# EAGLE design esp32_ili9488_module_board (EAGLE 9.6.2)
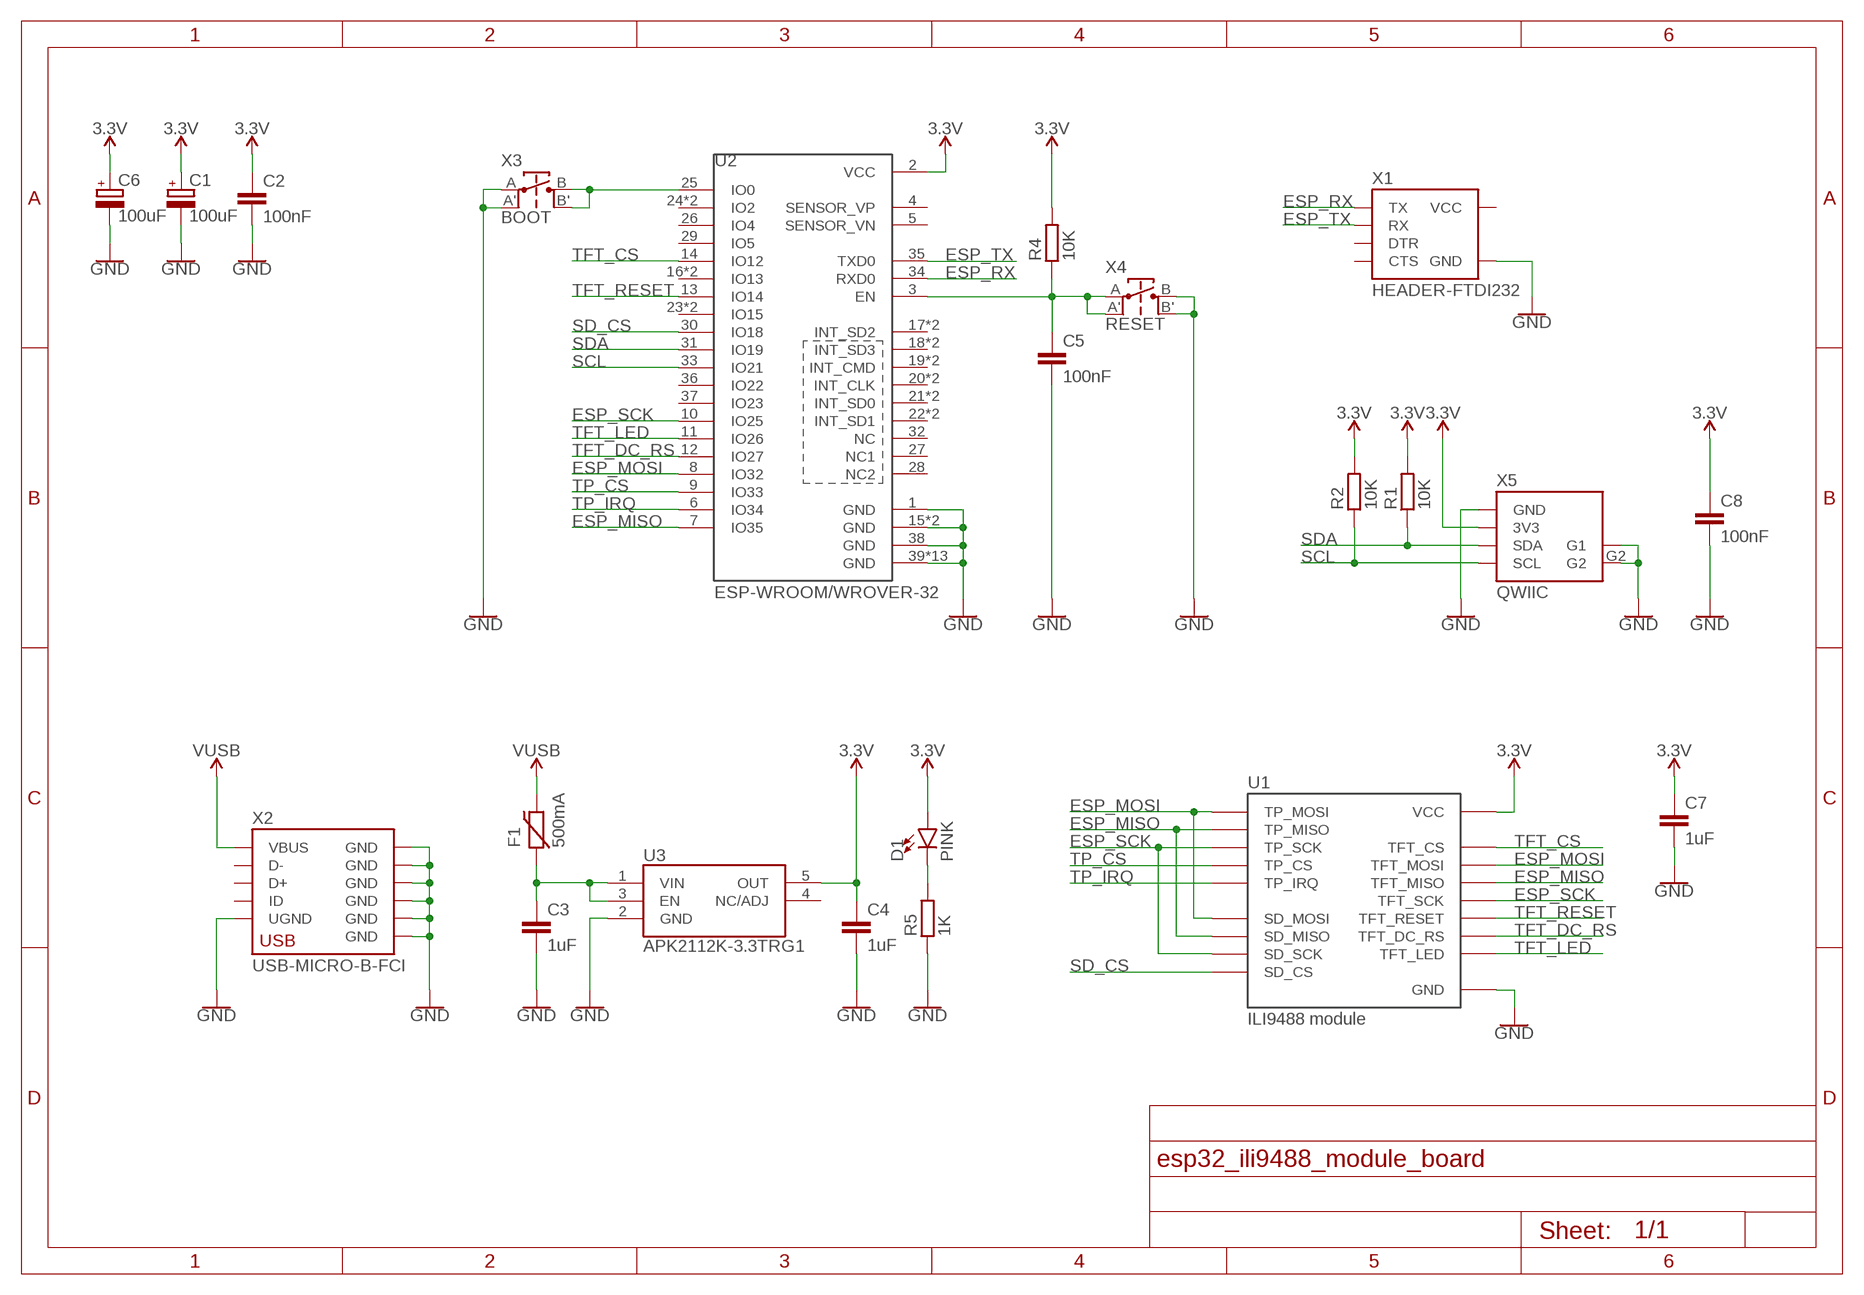
[diagram p0: schematic, sheet 1]

## Parts
C1  100uF  CAP-POL-ALUMPANASONIC-SV-C  [PANASONIC-SV-C]
C2  100nF  CAPC0603  [C0603]
C3  1uF  CAPC0603  [C0603]
C4  1uF  CAPC0603  [C0603]
C5  100nF  CAPC0603  [C0603]
C6  100uF  CAP-POL-ALUMPANASONIC-SV-C  [PANASONIC-SV-C]
C7  1uF  CAPC0603  [C0603]
C8  100nF  CAPC0603  [C0603]
D1  PINK  LED0603  [LED0603]
F1  500mA  PTC0ZCJ  [PTC-0ZCJ-1206]
R1  10K  RESISTOR0603  [R0603]
R2  10K  RESISTOR0603  [R0603]
R4  10K  RESISTOR0603  [R0603]
R5  1K  RESISTOR0603  [R0603]
U1  ILI9488 module  TFT-ILI9488-MODULE  [TFT-ILI9488-MODULE]
U2  ESP-WROOM/WROVER-32  ESP-WROOM_WROVER-32  [ESP-WROOM_WROVER-32]
U3  APK2112K-3.3TRG1  REGULATOR-AP2112KK-SOT23-5  [SOT23-5]
X1  HEADER-FTDI232  [FTDI232-1X06]
X2  USB-MICRO-B-FCI  [USB-MICRO-B-FCI]
X3  BOOT  TACT-SWITCHEVQ  [TACT-SWITCH-EVQ]
X4  RESET  TACT-SWITCHEVQ  [TACT-SWITCH-EVQ]
X5  QWIIC  QWIICRA  [JST-SH-4-SMD-RA]

## Nets
3.3V: C1.+ C2.1 C4.1 C6.+ C7.1 C8.1 D1.A R1.2 R2.2 R4.2 U1.VCC U2.2(VCC) U3.5(OUT) X5.3V3
ESP_MISO: U1.SD_MISO U1.TFT_MISO U1.TP_MISO U2.7(IO35)
ESP_MOSI: U1.SD_MOSI U1.TFT_MOSI U1.TP_MOSI U2.8(IO32)
ESP_RX: U2.34(RXD0) X1.TX
ESP_SCK: U1.SD_SCK U1.TFT_SCK U1.TP_SCK U2.10(IO25)
ESP_TX: U2.35(TXD0) X1.RX
GND: C1.- C2.2 C3.2 C4.2 C5.2 C6.- C7.2 C8.2 R5.1 U1.GND U2.1(GND) U2.15(GND) U2.15_R(GND) U2.38(GND) U2.39(GND) U2.39V_1(GND) U2.39V_2(GND) U2.39V_3(GND) U2.39V_4(GND) U2.39V_5(GND) U2.39V_6(GND) U2.39V_7(GND) U2.39V_8(GND) U2.39V_9(GND) U2.39V_10(GND) U2.39V_12(GND) U2.39V_13(GND) U3.2(GND) X1.GND X2.5(UGND) X2.GND@1(GND) X2.GND@2(GND) X2.GND@3(GND) X2.GND@4(GND) X2.GND@5(GND) X2.GND@6(GND) X3.A X3.A' X4.B X4.B' X5.G1 X5.G2 X5.GND
N$1: C3.1 F1.1 U3.1(VIN) U3.3(EN)
N$2: D1.C R5.2
N$3: C5.1 R4.1 U2.3(EN) X4.A X4.A'
N$4: U2.25(IO0) X3.B X3.B'
SCL: R2.1 U2.33(IO21) X5.SCL
SD_CS: U1.SD_CS U2.30(IO18)
SDA: R1.1 U2.31(IO19) X5.SDA
TFT_CS: U1.TFT_CS U2.14(IO12)
TFT_DC_RS: U1.TFT_DC_RS U2.12(IO27)
TFT_LED: U1.TFT_LED U2.11(IO26)
TFT_RESET: U1.TFT_RESET U2.13(IO14)
TP_CS: U1.TP_CS U2.9(IO33)
TP_IRQ: U1.TP_IRQ U2.6(IO34)
VUSB: F1.2 X2.1(VBUS)
Unconnected: U2.4(SENSOR_VP) U2.5(SENSOR_VN) U2.16(IO13) U2.16_R(IO13) U2.17(INT_SD2) U2.17_R(INT_SD2) U2.18(INT_SD3) U2.18_R(INT_SD3) U2.19(INT_CMD) U2.19_R(INT_CMD) U2.20(INT_CLK) U2.20_R(INT_CLK) U2.21(INT_SD0) U2.21_R(INT_SD0) U2.22(INT_SD1) U2.22_R(INT_SD1) U2.23(IO15) U2.23_R(IO15) U2.24(IO2) U2.24_R(IO2) U2.26(IO4) U2.27(NC1) U2.28(NC2) U2.29(IO5) U2.32(NC) U2.36(IO22) U2.37(IO23) U3.4(NC/ADJ) X1.CTS X1.DTR X2.2(D-) X2.3(D+) X2.4(ID)

## Power pins joined to a net without a drawn wire
VCC: X1.VCC

## Library data of the parts
C1 C6 = M2M-Passives:CAP-POL-ALUM
C2-C5 C7 C8 = M2M-Passives:CAP
D1 = M2M-LED:LED: LED (Generic) Standard schematic elements and footprints for 5mm, 3mm, 1206, and 0603 sized LEDs. Generic LEDs with no color specified.
F1 = M2M-Fuse:PTC
R1 R2 R4 R5 = M2M-Passives:RESISTOR
U1 = M2M-Modules:TFT-ILI9488-MODULE
U2 = M2M-Modules:ESP-WROOM_WROVER-32
U3 = M2M-IC:REGULATOR-AP2112K
X1 = M2M-Connectors:HEADER-FTDI232
X2 = M2M-Connectors:USB-MICRO-B-FCI: FCI-10118192-0001LF 609-4613-1-ND
X3 X4 = M2M-Switches:TACT-SWITCH
X5 = M2M-Connectors:QWIIC

## Board
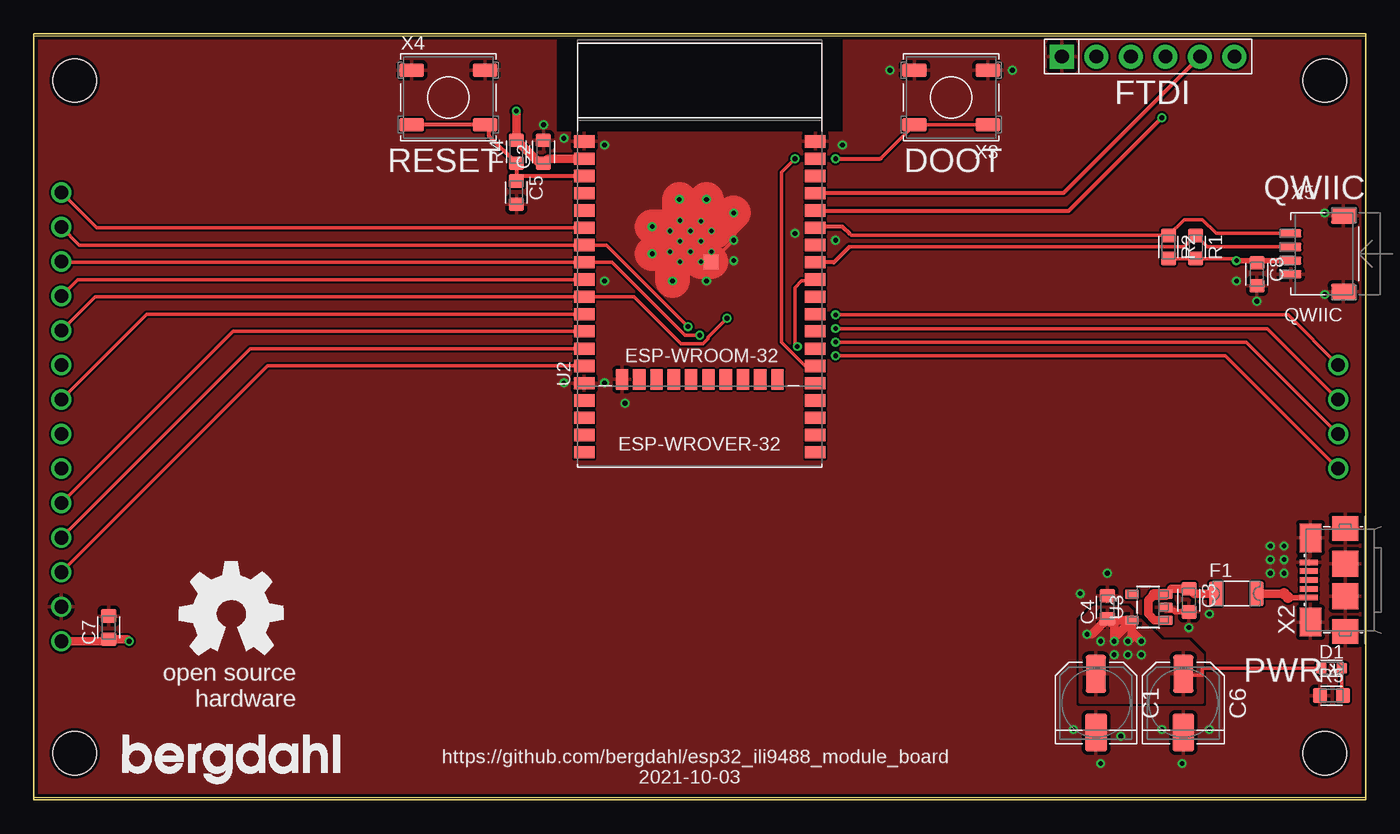
[diagram p1: board, top side]
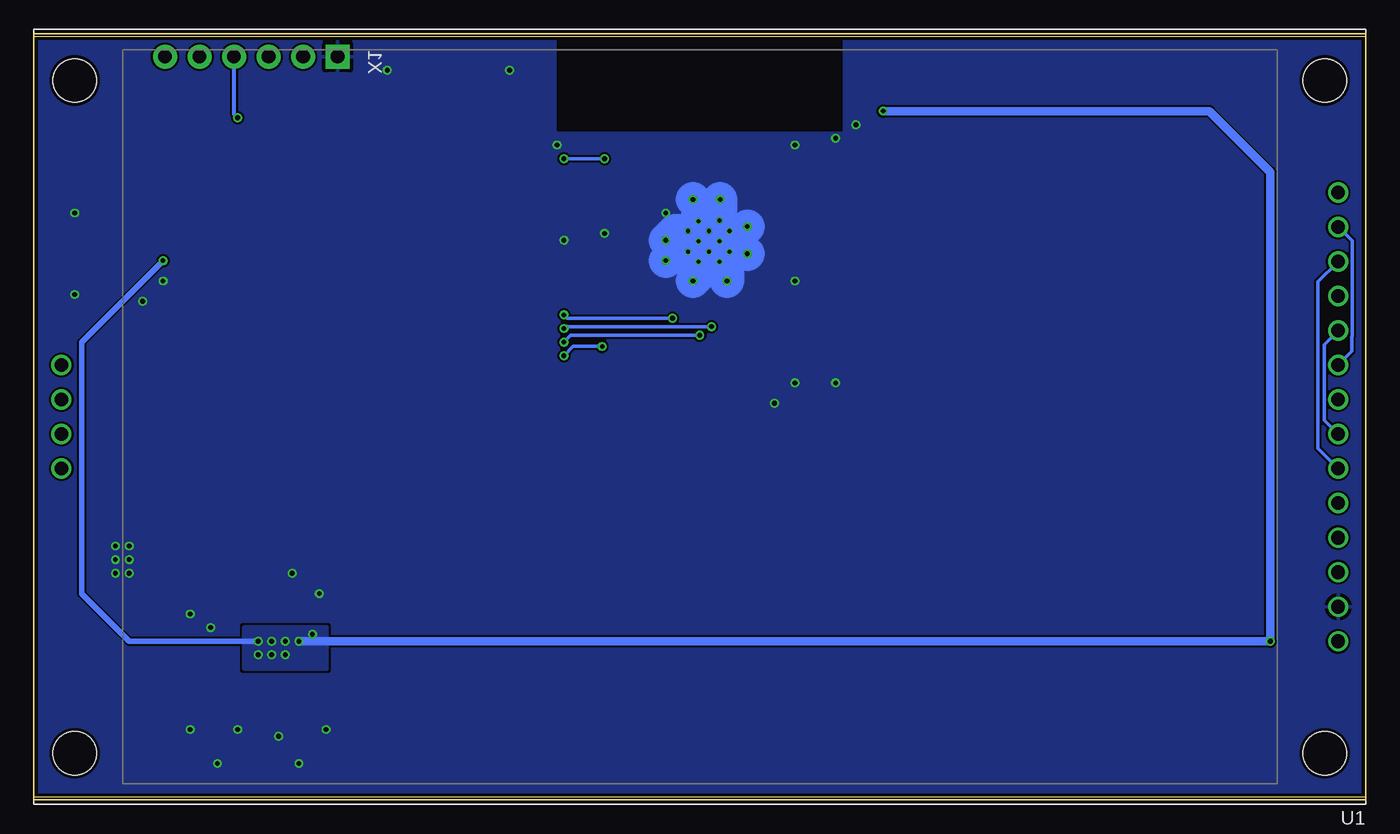
[diagram p2: board, bottom side, seen from below]

Size 98 x 56 mm. Coordinates in mm from the lower left corner, seen from the top.
Outline: 0,0 98,0 98,56 0,56 0,0
Copper layers (1*16): Top 0.035mm / dielectric 1.5mm / Bottom 0.035mm
Design rules "SeeedStudio_2layer_DRU_no_angle_20140221": minimum track width 6mil, minimum drill 0.3mm, track to track 6mil, track to pad 6mil, pad to pad 6mil, via to via 6mil, smd to smd 0mil, copper to edge 10mil, drill to drill 10mil, minimum pad ring 2mil, minimum via ring 6mil, stop-mask expansion 2mil, vias tented up to drill 1000mil, thermal gap 10mil

### Footprints (pad centres in the part's own frame; a part is rotated, then mirrored left to right if it is on the bottom)
PANASONIC-SV-C = smd 1.5 x 2.8: + 0,-2.15 | smd 1.6 x 2.8: - 0,2.15
C0603 = smd 1 x 1.1: 1 -0.85,0; 2 0.85,0
LED0603 = smd 0.8 x 0.8: A -0.75,0; C 0.75,0
PTC-0ZCJ-1206 = smd 1 x 1.8: 1 -1.5,0; 2 1.5,0
R0603 = smd 1 x 1.1: 1 -0.85,0; 2 0.85,0
TFT-ILI9488-MODULE = drill 1: GND -46.99,13.97; SD_CS 46.99,3.81; SD_MISO 46.99,-1.27; SD_MOSI 46.99,1.27; SD_SCK 46.99,-3.81; TFT_CS -46.99,11.43; TFT_DC_RS -46.99,6.35; TFT_LED -46.99,-1.27; TFT_MISO -46.99,-3.81; TFT_MOSI -46.99,3.81; TFT_RESET -46.99,8.89; TFT_SCK -46.99,1.27; TP_CS -46.99,-8.89; TP_IRQ -46.99,-16.51; TP_MISO -46.99,-13.97; TP_MOSI -46.99,-11.43; TP_SCK -46.99,-6.35; VCC -46.99,16.51 | hole 3.2: -46,24.75; -46,-24.75; 46,-24.75; 46,24.75
ESP-WROOM_WROVER-32 = smd 1.5 x 0.9: 1 -8.5,5.26; 2 -8.5,3.99; 3 -8.5,2.72; 4 -8.5,1.45; 5 -8.5,0.18; 6 -8.5,-1.09; 7 -8.5,-2.36; 8 -8.5,-3.63; 9 -8.5,-4.9; 10 -8.5,-6.17; 11 -8.5,-7.44; 12 -8.5,-8.71; 13 -8.5,-9.98; 14 -8.5,-11.25; 15_R -8.5,-12.52; 16_R -8.5,-13.79; 17_R -8.5,-15.06; 18_R -8.5,-16.33; 19_R -8.5,-17.6; 20_R 8.5,-17.6; 21_R 8.5,-16.33; 22_R 8.5,-15.06; 23_R 8.5,-13.79; 24_R 8.5,-12.52; 25 8.5,-11.25; 26 8.5,-9.98; 27 8.5,-8.71; 28 8.5,-7.44; 29 8.5,-6.17; 30 8.5,-4.9; 31 8.5,-3.63; 32 8.5,-2.36; 33 8.5,-1.09; 34 8.5,0.18; 35 8.5,1.45; 36 8.5,2.72; 37 8.5,3.99; 38 8.5,5.26 | smd 0.9 x 1.5: 15 -5.715,-12.25; 16 -4.445,-12.25; 17 -3.175,-12.25; 18 -1.905,-12.25; 19 -0.635,-12.25; 20 0.635,-12.25; 21 1.905,-12.25; 22 3.175,-12.25; 23 4.445,-12.25; 24 5.715,-12.25 | smd 1.05 x 1.05: 39 0.845,-3.605 | drill 0.3: 39V_1 -1.44,-0.55; 39V_2 0.085,-0.6; 39V_3 -2.19,-1.325; 39V_4 -0.69,-1.325; 39V_5 0.86,-1.325; 39V_6 -1.44,-2.075; 39V_7 0.085,-2.075; 39V_8 -2.19,-2.85; 39V_9 -0.69,-2.85; 39V_10 0.86,-2.85; 39V_12 -1.44,-3.6; 39V_13 0.085,-3.6
SOT23-5 = smd 0.7 x 1: 1 -0.95,-1.3; 2 0,-1.3; 3 0.95,-1.3; 4 0.95,1.2; 5 -0.95,1.2
FTDI232-1X06 = drill 1 pad 1.778: CTS 0,3.81; DTR 0,-6.35; RX 0,-3.81; TX 0,-1.27; VCC 0,1.27 | drill 1 pad 1.778 square: GND 0,6.35
USB-MICRO-B-FCI = smd 0.4 x 1.35: 1 -1.3,2.675; 2 -0.65,2.675; 3 0,2.675; 4 0.65,2.675; 5 1.3,2.675 | smd 2.1 x 1.6: GND@1 -3.1,2.55; GND@2 3.1,2.55 | smd 1.8 x 1.9: GND@3 -3.8,0; GND@6 3.8,0 | smd 1.9 x 1.9: GND@4 -1.2,0; GND@5 1.2,0
TACT-SWITCH-EVQ = smd 1.8 x 1: A -2.7,-2; A' 2.7,-2; B -2.7,2; B' 2.7,2
JST-SH-4-SMD-RA = smd 0.6 x 1.55: 3V3 0.5,-2; GND 1.5,-2; SCL -1.5,-2; SDA -0.5,-2 | smd 1.2 x 1.8: G1 2.8,1.875; G2 -2.8,1.875

### Placement (x,y rotation side)
C1  78.16,6.94 180 top
C2  37.5,47.5 90 top
C3  85,14.5 270 top
C4  79,14 90 top
C5  35.5,44.5 270 top
C6  84.59,6.94 180 top
C7  5.5,12.5 90 top
C8  90,38.5 270 top
D1  95.5,9.5 0 top
F1  88.5,15 0 top
R1  85.5,40.5 270 top
R2  83.5,40.5 270 top
R4  35.5,47.5 90 top
R5  95.5,7.5 0 top
U1  49,28 180 bottom
U2  49,43 0 top
U3  82,14 90 top
U$1  [BERGDAHL-20MM-TPLACE]  6.5,1 0 top
U$2  [OSHW-8MM-TPLACE]  14.5,13.5 0 top
X1  82,54.5 90 top
X2  96.5,16 90 top
X3  67.5,51.5 180 top
X4  30.5,51.5 0 top
X5  94.5,40 270 top

### Tracks (layer width: path | path; a pad name or v marks a point on that pad's centre or on a via)
3.3V  (via drill 0.35)
  Top 0.254: D1.A 86,9.5 86,9 84.68,9 C6.+ | R2.2 R1.2 88.35,39.65 v88.5,39.5
  Top 0.406: v88.5,39.5 89.85,39.5 | 89.85,39.5 C8.1 | X5.3V3 89.85,39.5
  Top 0.61: v35.5,50.5 R4.2 37.2,46.65 C2.1 37.84,46.99 U2.2 | 80.8,12.2 80.8,11.8 v80.5,11.5 | U3.5 79.1,13.05 C4.1 | C4.1 79.5,12.65 v79.5,11.5 79.5,11.75 U3.5 | C4.1 77.85,12 v77.5,12 | v81.5,11.5 80.8,12.2 | 80.8,12.2 U3.5 | U1.VCC 5.34,11.49 C7.1 6.85,11.65 v7,11.5
  Bottom 0.406: v81.5,11.5 91,11.5 94.5,15 94.5,33.5 v88.5,39.5
  Bottom 0.61: v35.5,50.5 11.5,50.5 7,46 v7,11.5 v78.5,11.5
  other vias: 80.5,10.5 79.5,10.5 81.5,10.5
  pour Top: 77,7 86,7 86,10.5 85,11.5 83,11.5 80.5,14 78,14 77,13
  pour Bottom: 76.5,12.5 82.5,12.5 82.5,9.5 76.5,9.5
ESP_MISO  (via drill 0.35)
  Top 0.254: U1.TP_MISO 3.34,40.64 U2.7 42.14,40.64 v48.14,34.64 | v59,34.5 90.76,34.5 U1.SD_MISO
  Bottom 0.254: U1.TP_MISO 0.98,40.94 0.98,39 0.99,38.99 0.99,37.33 0.98,37.32 0.98,33.92 1,33.9 1,32.82 U1.TFT_MISO | v48.14,34.64 58.86,34.64 v59,34.5
ESP_MOSI  (via drill 0.35)
  Top 0.254: U1.TP_MOSI 2.07,39.37 U2.8 42.55,39.37 47.92,34 v49,34 | v59,33.5 89.22,33.5 U1.SD_MOSI
  Bottom 0.254: U1.TFT_MOSI 3.5,25.68 3.5,37.94 U1.TP_MOSI | v49,34 58.5,34 v59,33.5
ESP_RX  (via drill 0.35)
  Top 0.305: v83,50 76.18,43.18 U2.34
  Bottom 0.305: v83,50 83.27,50.27 X1.TX
ESP_SCK  (via drill 0.35)
  Top 0.254: U1.TP_SCK 4.49,36.83 U2.10 44.17,36.83 47.61,33.39 49.25,33.39 49.61,33.75 49.61,33.85 v51,35.25 | v59,35.5 92.3,35.5 U1.SD_SCK
  Bottom 0.254: U1.TP_SCK 3.04,33.32 3.04,27.76 U1.TFT_SCK | v51,35.25 58.75,35.25 v59,35.5
ESP_TX
  Top 0.305: U2.35 57.55,44.5 75.81,44.5 X1.RX
GND  (via drill 0.35)
  Top 0.254: U2.39V_13 | U2.39V_10 50.65,40.15 v51.5,41 | U2.39V_5 50.17,41.67
  Top 0.406: C3.2 84,13.65 83.9,13.76 83.54,13.76 U3.2 | 49.09,43.33 50.52,43.33 50.84,43 v51.5,43
  Top 2.54: U2.39 U2.39V_13 | 50.17,41.67 v51.5,43 | U2.39V_1 47.5,42.51 v47.5,44 | U2.39V_3 46.48,42 v45.5,42 | U2.39V_8 45.65,40.15 v45.5,40 | U2.39V_12 47,38.84 v47,38 | U2.39V_6 U2.39V_7 | U2.39V_2 49.5,42.81 v49.5,44
  Bottom 2.54: U2.39V_3 45.83,41.67 v45.5,42 | U2.39V_8 45.65,40.15 v45.5,40 | U2.39V_12 47,38.84 v47,38 | U2.39V_13 49.09,38.41 v49.5,38 | U2.39V_2 49.09,43.59 v49.5,44 | U2.39V_5 50.83,41.67 v51.5,41 | U2.39V_7 U2.39V_6 | U2.39V_1 47.5,42.51 v47.5,44 | U2.39V_10 50.85,40.15 v51.5,39.5
  other vias: 59,41 59.5,48 91,18.5 92,18.5 92,17.5 91,16.5 92,16.5 91,17.5 86.5,5 84.5,2.5 83,5 80,4.5 78.5,2.5 76.5,5 79,16.5 77,15 86.5,13.5 85,12.5 95,37 95,43 88.5,38 90,36.5 72,53.5 63,53.5 39,30.5 42,30.5 43.5,29 37.5,49.5 39,48.5 42,48 56,41.5 42,38
  pour Top (rank 4): 0,56.5 98,56.5 98,-0.5 0,-0.5
  pour Bottom (rank 4): 98,56.5 0,56.5 0,-0.5 98,-0.5
N$1
  Top 0.406: 85.35,15 C3.1 | U3.3 83.7,15.35
  Top 0.61: F1.1 85.35,15 | 83.7,15.35 C3.1 | U3.1 82.45,13.05 82,13.5 82,14.5 82.45,14.95
  Top 0.813: 82.45,14.95 U3.3
N$2
  Top 0.254: D1.C 96.25,7.6 R5.2
N$3
  Top 0.305: U2.3 35.87,45.72 C5.1 R4.1 33.5,48.65 33.5,49 33.2,49.3 X4.A' X4.A
N$4  (via drill 0.35)
  Top 0.254: 62.3,47 X3.B' X3.B | v56,47 55,46 55,33.5 56.75,31.75 U2.25
  Top 0.305: v59,47 62.3,47
  Bottom 0.254: v56,47 v59,47
SCL
  Top 0.254: 60,41.5 60.15,41.35 R2.1 84.65,42.5 86,42.5 87,41.5 X5.SCL
  Top 0.305: 60,41.5 59.5,42 57.59,42 U2.33
SD_CS  (via drill 0.35)
  Top 0.254: U2.30 57.4,38 56.5,38 56,37.5 56,33.36 v56.18,33.18 | v59,32.5 87.68,32.5 U1.SD_CS
  Bottom 0.254: v56.18,33.18 58.32,33.18 v59,32.5
SDA
  Top 0.254: 60,40.5 84.65,40.5 R1.1 86.35,40.5 X5.SDA
  Top 0.305: U2.31 58.87,39.37 60,40.5
TFT_CS
  Top 0.254: U2.14 22.5,31.75 22.27,31.75 17.19,31.75 U1.TFT_CS
TFT_DC_RS
  Top 0.254: U2.12 14.65,34.29 U1.TFT_DC_RS
TFT_LED
  Top 0.254: U2.11 11,35.56 10.84,35.56 8.3,35.56 U1.TFT_LED
TFT_RESET
  Top 0.254: U1.TFT_RESET 15.92,33.02 U2.13
TP_CS
  Top 0.254: U2.9 8.5,38.1 8.3,38.1 3.22,38.1 U1.TP_CS
TP_IRQ
  Top 0.254: U2.6 4.61,41.91 U1.TP_IRQ
VUSB
  Top 0.406: X2.1 92.3,14.7
  Top 0.61: 92,15 F1.2
  Top 0.813: 92.3,14.7 92,15

### Text on the board
tPlace: FTDI | RESET | DOOT | QWIIC | ESP-WROOM-32 | ESP-WROVER-32 | PWR | https://github.com/bergdahl/esp32_ili9488_module_board | 2021-10-03